# Altium schematic sheet Э3_3.SchDoc
size 420 x 297 mm; SheetNumber: 3; Scale: 1:1; DocumentType: Схема электрическая принципиальная
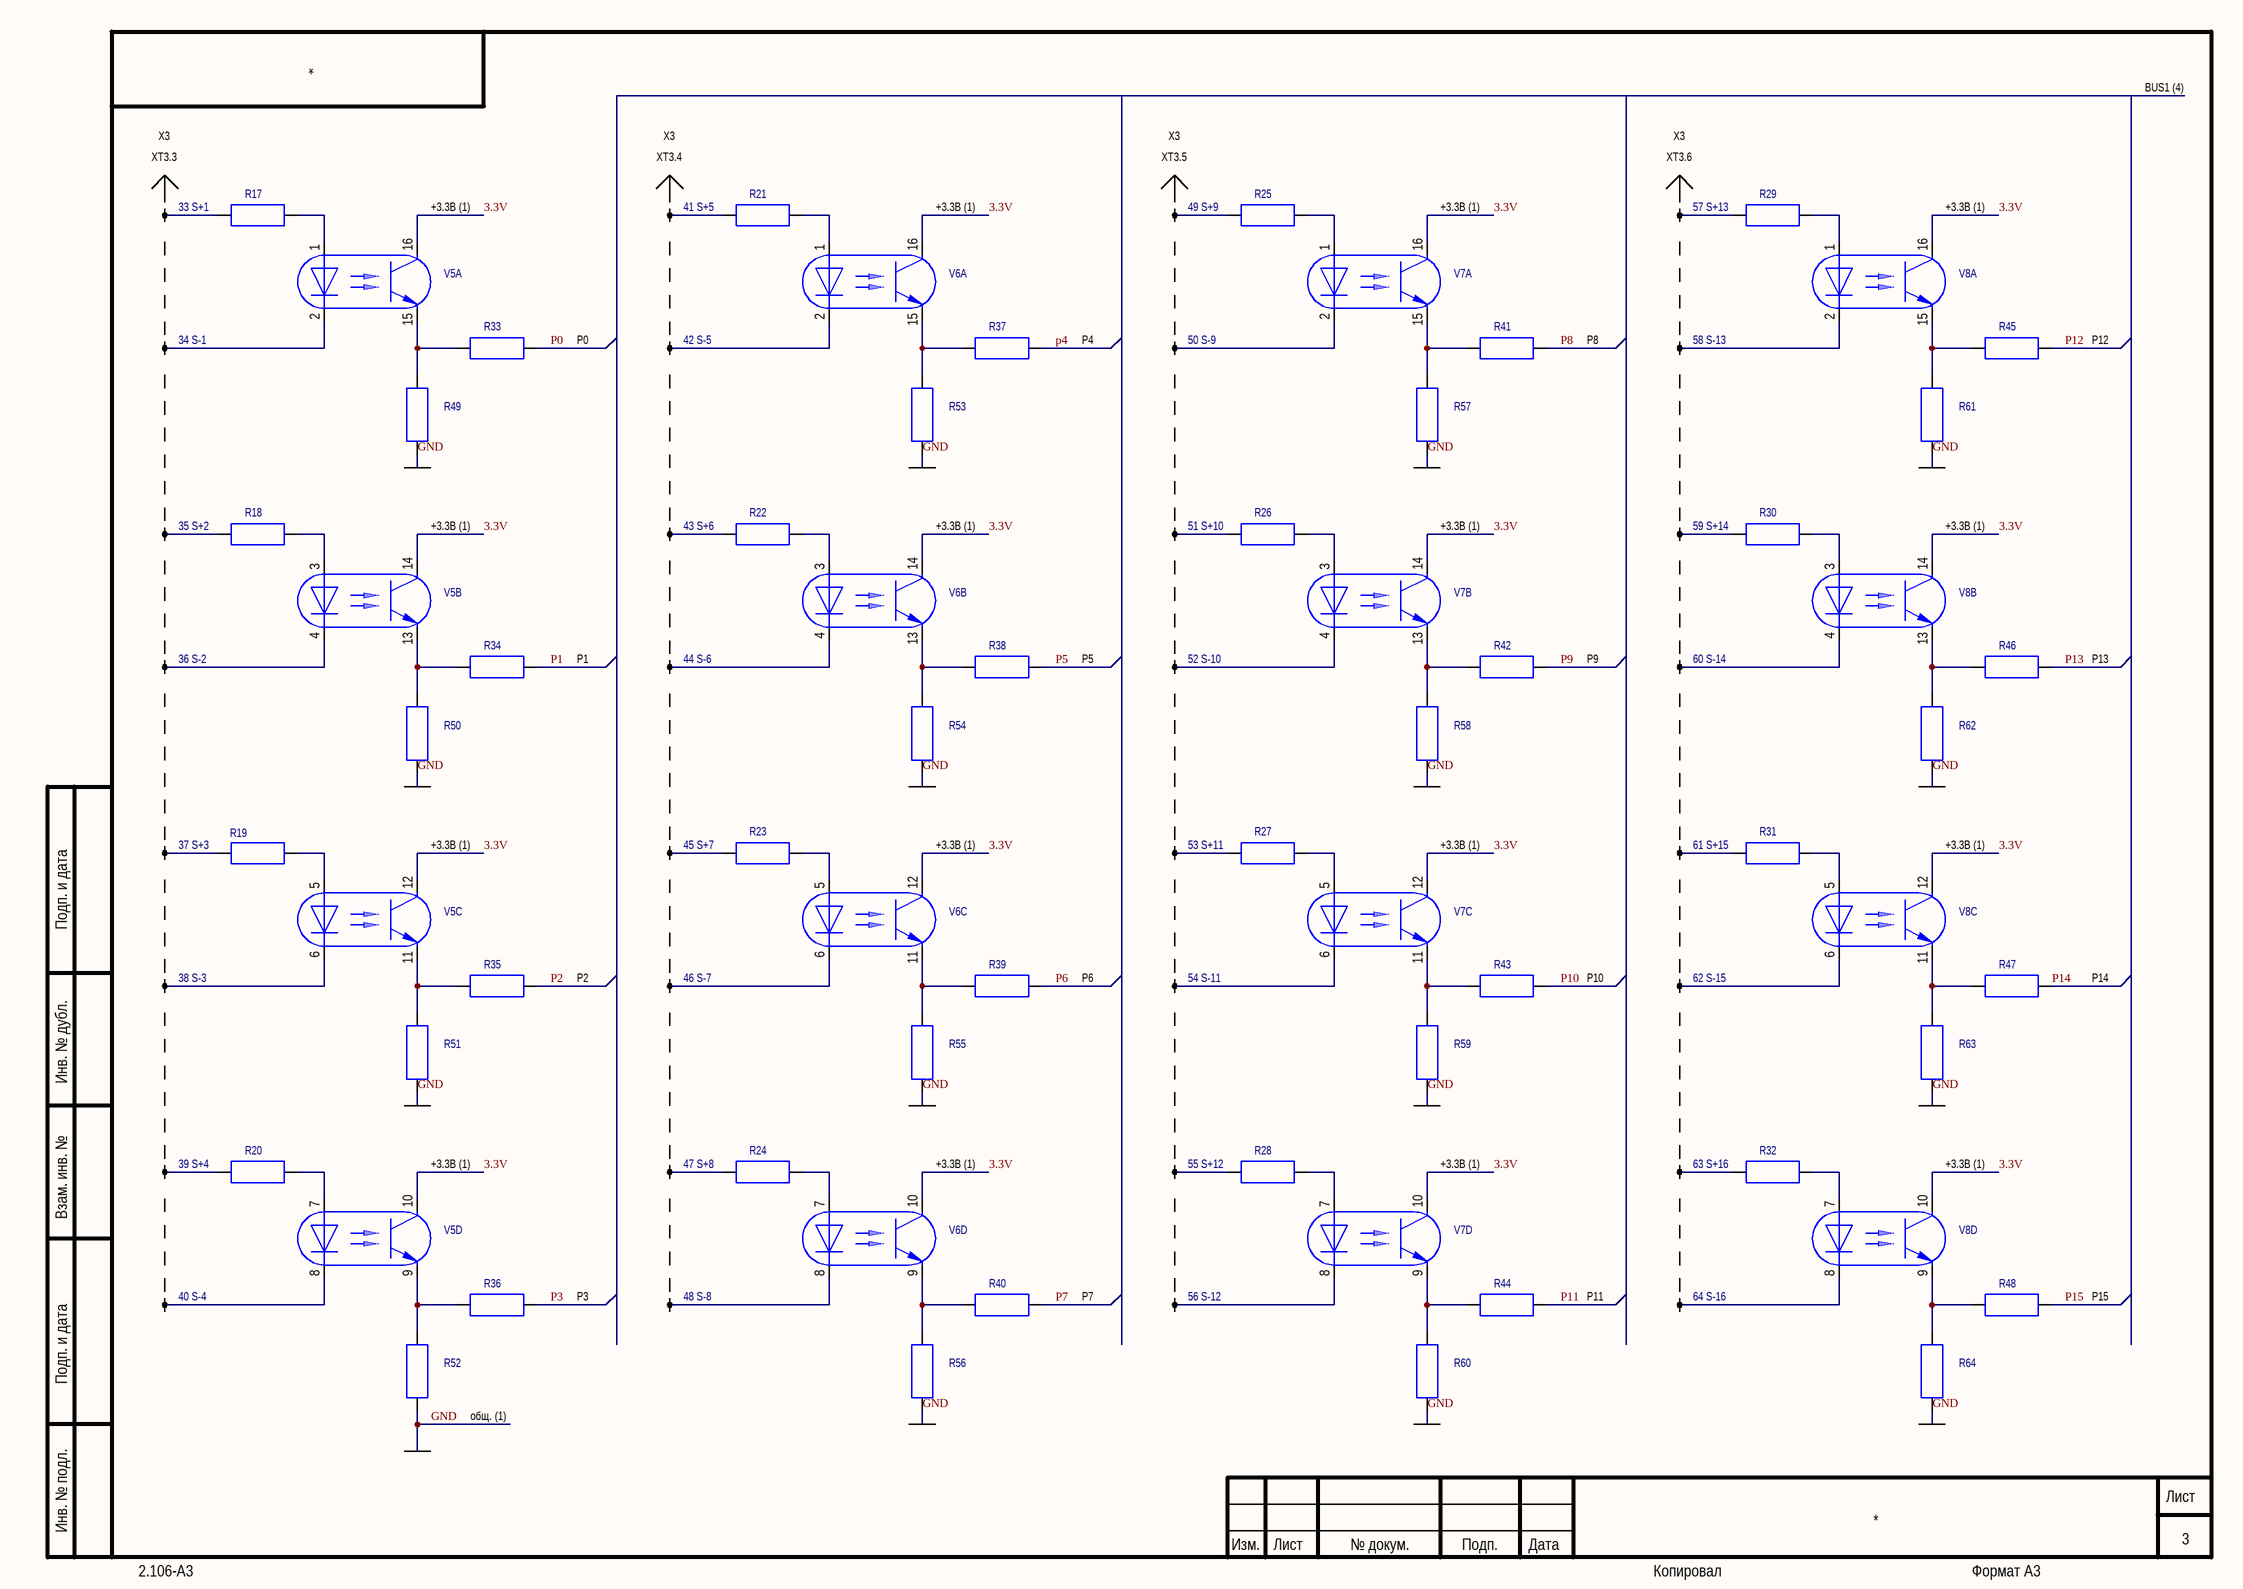
[diagram p0: Э3_3.SchDoc]

## Parts
R17  380  [RES0805]  (value not drawn)
R18  380  [RES0805]  (value not drawn)
R19  380  [RES0805]  (value not drawn)
R20  380  [RES0805]  (value not drawn)
R21  380  [RES0805]  (value not drawn)
R22  380  [RES0805]  (value not drawn)
R23  380  [RES0805]  (value not drawn)
R24  380  [RES0805]  (value not drawn)
R25  380  [RES0805]  (value not drawn)
R26  380  [RES0805]  (value not drawn)
R27  380  [RES0805]  (value not drawn)
R28  380  [RES0805]  (value not drawn)
R29  380  [RES0805]  (value not drawn)
R30  380  [RES0805]  (value not drawn)
R31  380  [RES0805]  (value not drawn)
R32  380  [RES0805]  (value not drawn)
R33  10к  [RES0805]  (value not drawn)
R34  10к  [RES0805]  (value not drawn)
R35  10к  [RES0805]  (value not drawn)
R36  10к  [RES0805]  (value not drawn)
R37  10к  [RES0805]  (value not drawn)
R38  10к  [RES0805]  (value not drawn)
R39  10к  [RES0805]  (value not drawn)
R40  10к  [RES0805]  (value not drawn)
R41  10к  [RES0805]  (value not drawn)
R42  10к  [RES0805]  (value not drawn)
R43  10к  [RES0805]  (value not drawn)
R44  10к  [RES0805]  (value not drawn)
R45  10к  [RES0805]  (value not drawn)
R46  10к  [RES0805]  (value not drawn)
R47  10к  [RES0805]  (value not drawn)
R48  10к  [RES0805]  (value not drawn)
R49  1к  [RES0805]  (value not drawn)
R50  1к  [RES0805]  (value not drawn)
R51  1к  [RES0805]  (value not drawn)
R52  1к  [RES0805]  (value not drawn)
R53  1к  [RES0805]  (value not drawn)
R54  1к  [RES0805]  (value not drawn)
R55  1к  [RES0805]  (value not drawn)
R56  1к  [RES0805]  (value not drawn)
R57  1к  [RES0805]  (value not drawn)
R58  1к  [RES0805]  (value not drawn)
R59  1к  [RES0805]  (value not drawn)
R60  1к  [RES0805]  (value not drawn)
R61  1к  [RES0805]  (value not drawn)
R62  1к  [RES0805]  (value not drawn)
R63  1к  [RES0805]  (value not drawn)
R64  1к  [RES0805]  (value not drawn)
V5  ACPL247_1  [SOP127P700X220-16N]  (value not drawn)  (parts A,B,C,D of 4)
V6  ACPL247_1  [SOP127P700X220-16N]  (value not drawn)  (parts A,B,C,D of 4)
V7  ACPL247_1  [SOP127P700X220-16N]  (value not drawn)  (parts A,B,C,D of 4)
V8  ACPL247_1  [SOP127P700X220-16N]  (value not drawn)  (parts A,B,C,D of 4)
X3  33 S+1  [PLD64]  (parts 33,34,35,36,37,38,39,40,41,42,43,44,45,46,47,48,49,50,51,52,53,54,55,56,57,58,59,60,61,62,63,64 of 64)

## Nets
3.3V: V5.10 V5.12 V5.14 V5.16 V6.10 V6.12 V6.14 V6.16 V7.10 V7.12 V7.14 V7.16 V8.10 V8.12 V8.14 V8.16
GND: R49.1 R50.1 R51.1 R52.1 R53.1 R54.1 R55.1 R56.1 R57.1 R58.1 R59.1 R60.1 R61.1 R62.1 R63.1 R64.1
P0: R33.2
P1: R34.2
P2: R35.2
P3: R36.2
p4: R37.2
P5: R38.2
P6: R39.2
P7: R40.2
P8: R41.2
P9: R42.2
P10: R43.2
P11: R44.2
P12: R45.2
P13: R46.2
P14: R47.2
P15: R48.2
NetR17_1: R17.1 X3.8
NetR17_2: R17.2 V5.1
NetR18_1: R18.1 X3.24
NetR18_2: R18.2 V5.3
NetR19_1: R19.1 X3.28
NetR19_2: R19.2 V5.5
NetR20_1: R20.1 X3.30
NetR20_2: R20.2 V5.7
NetR21_1: R21.1 X3.33
NetR21_2: R21.2 V6.1
NetR22_1: R22.1 X3.37
NetR22_2: R22.2 V6.3
NetR23_1: R23.1 X3.40
NetR23_2: R23.2 V6.5
NetR24_1: R24.1 X3.44
NetR24_2: R24.2 V6.7
NetR25_1: R25.1 X3.25
NetR25_2: R25.2 V7.1
NetR26_1: R26.1 X3.10
NetR26_2: R26.2 V7.3
NetR27_1: R27.1 X3.12
NetR27_2: R27.2 V7.5
NetR28_1: R28.1 X3.14
NetR28_2: R28.2 V7.7
NetR29_1: R29.1 X3.16
NetR29_2: R29.2 V8.1
NetR30_1: R30.1 X3.18
NetR30_2: R30.2 V8.3
NetR31_1: R31.1 X3.20
NetR31_2: R31.2 V8.5
NetR32_1: R32.1 X3.22
NetR32_2: R32.2 V8.7
NetR33_1: R33.1 R49.2 V5.15
NetR34_1: R34.1 R50.2 V5.13
NetR35_1: R35.1 R51.2 V5.11
NetR36_1: R36.1 R52.2 V5.9
NetR37_1: R37.1 R53.2 V6.15
NetR38_1: R38.1 R54.2 V6.13
NetR39_1: R39.1 R55.2 V6.11
NetR40_1: R40.1 R56.2 V6.9
NetR41_1: R41.1 R57.2 V7.15
NetR42_1: R42.1 R58.2 V7.13
NetR43_1: R43.1 R59.2 V7.11
NetR44_1: R44.1 R60.2 V7.9
NetR45_1: R45.1 R61.2 V8.15
NetR46_1: R46.1 R62.2 V8.13
NetR47_1: R47.1 R63.2 V8.11
NetR48_1: R48.1 R64.2 V8.9
NetV5_2: V5.2 X3.9
NetV5_4: V5.4 X3.27
NetV5_6: V5.6 X3.29
NetV5_8: V5.8 X3.31
NetV6_2: V6.2 X3.35
NetV6_4: V6.4 X3.38
NetV6_6: V6.6 X3.42
NetV6_8: V6.8 X3.46
NetV7_2: V7.2 X3.26
NetV7_4: V7.4 X3.11
NetV7_6: V7.6 X3.13
NetV7_8: V7.8 X3.15
NetV8_2: V8.2 X3.17
NetV8_4: V8.4 X3.19
NetV8_6: V8.6 X3.21
NetV8_8: V8.8 X3.23

## Notes on the sheet
- X3
- BUS1 (4)
- XT3.3
- XT3.4
- XT3.5
- XT3.6
- (near V5) +3.3В (1)
- (near V6) +3.3В (1)
- (near V7) +3.3В (1)
- (near V8) +3.3В (1)
- P0
- P4
- P8
- (near R45) P12
- P1
- P5
- P9
- (near R46) P13
- P2
- P6
- P10
- (near R47) P14
- P3
- P7
- P11
- (near R48) P15
- общ. (1)
- Подп. и дата
- Инв. № дубл.
- Взам. инв. №
- Инв. № подл.
- Изм.
- Лист
- № докум.
- Подп.
- Дата
- 2.106-A3
- Копировал
- Формат А3

## Library data of the parts
R17-R64 = R
X3 = PLD64